# EAGLE schematic Schematic_V0.3 (EAGLE 9.7.0)
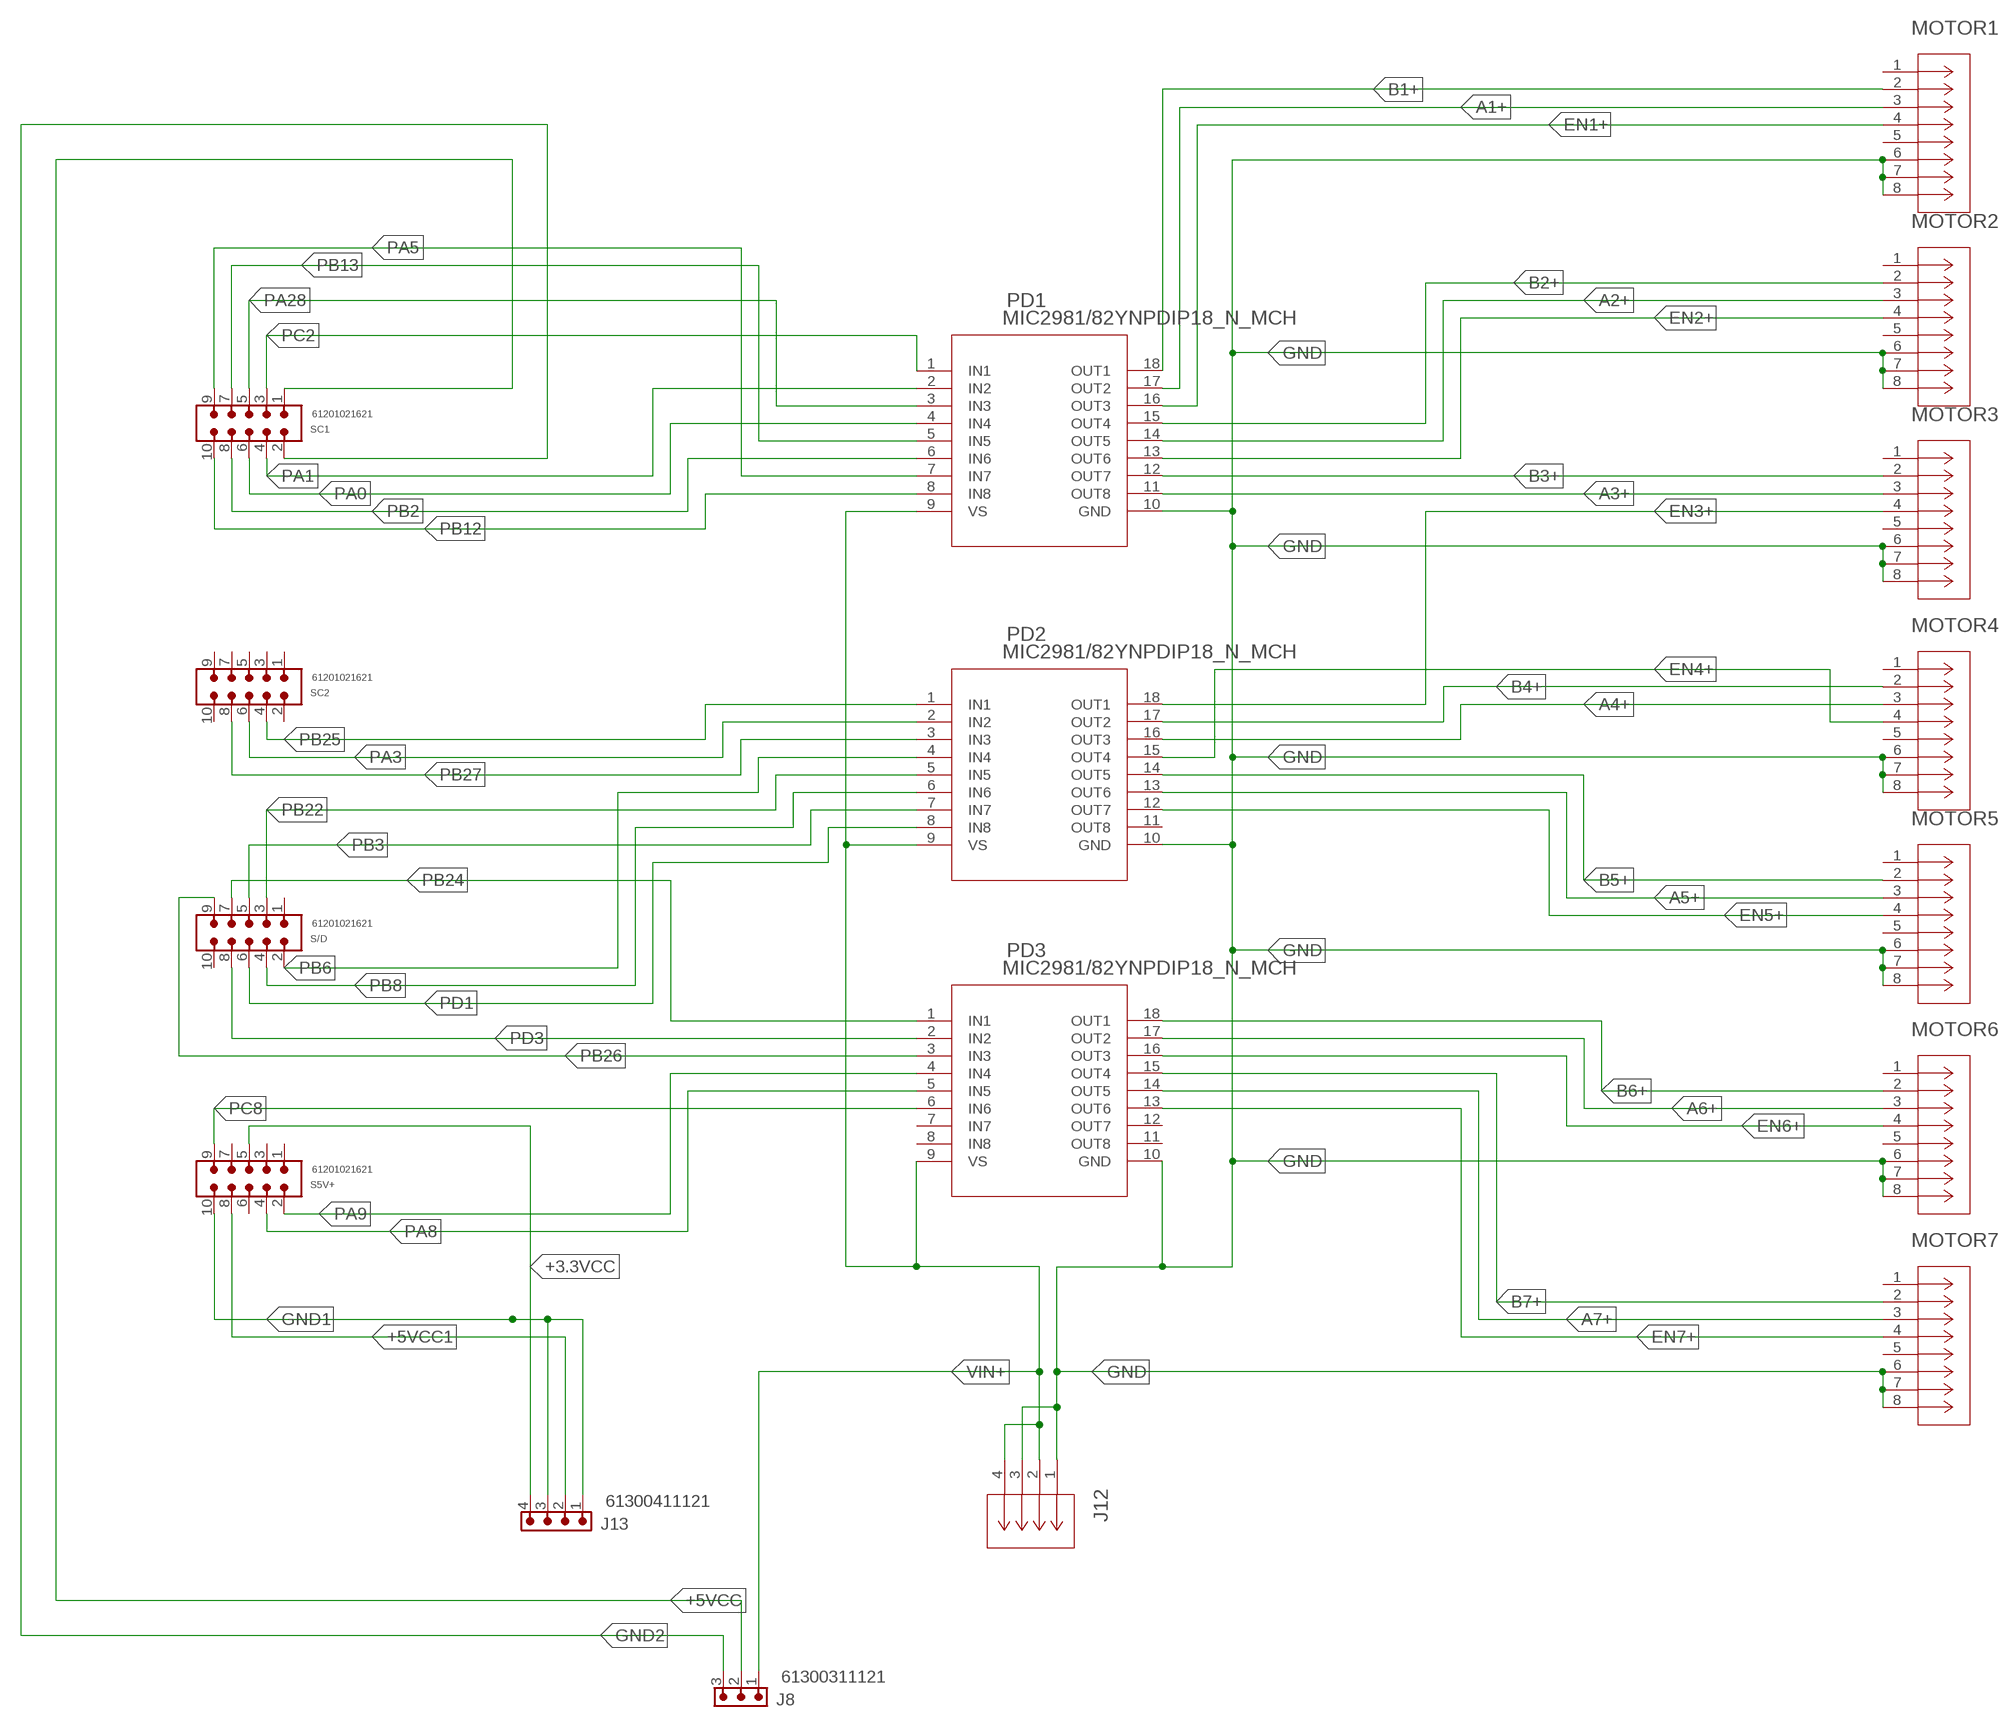
[diagram p0: schematic, sheet 1]

## Parts
J8  61300311121  6130XX11121_61300311121  [61300311121]
J12  YK3310403000GCONN_YK331040XX00G_AMP  [CONN_YK331040XX00G_AMP]
J13  61300411121  6130XX11121_61300411121  [61300411121]
MOTOR1  1724470208CON_1724470208  [CON_1724470208]
MOTOR2  1724470208CON_1724470208  [CON_1724470208]
MOTOR3  1724470208CON_1724470208  [CON_1724470208]
MOTOR4  1724470208CON_1724470208  [CON_1724470208]
MOTOR5  1724470208CON_1724470208  [CON_1724470208]
MOTOR6  1724470208CON_1724470208  [CON_1724470208]
MOTOR7  1724470208CON_1724470208  [CON_1724470208]
PD1  MIC2981/82YNPDIP18_N_MCH  [PDIP18_N_MCH]
PD2  MIC2981/82YNPDIP18_N_MCH  [PDIP18_N_MCH]
PD3  MIC2981/82YNPDIP18_N_MCH  [PDIP18_N_MCH]
S5V+  61201021621  6120XX21621_61201021621  [61201021621]
S/D  61201021621  6120XX21621_61201021621  [61201021621]
SC1  61201021621  6120XX21621_61201021621  [61201021621]
SC2  61201021621  6120XX21621_61201021621  [61201021621]

## Nets
+3.3VCC: J13.4 S5V+.5
+5VCC: J8.2 SC1.1
+5VCC1: J13.2 S5V+.8
A1+: MOTOR1.3 PD1.17(OUT2)
A2+: MOTOR2.3 PD1.14(OUT5)
A3+: MOTOR3.3 PD1.11(OUT8)
A4+: MOTOR4.3 PD2.16(OUT3)
A5+: MOTOR5.3 PD2.13(OUT6)
A6+: MOTOR6.3 PD3.17(OUT2)
A7+: MOTOR7.3 PD3.14(OUT5)
B1+: MOTOR1.2 PD1.18(OUT1)
B2+: MOTOR2.2 PD1.15(OUT4)
B3+: MOTOR3.2 PD1.12(OUT7)
B4+: MOTOR4.2 PD2.17(OUT2)
B5+: MOTOR5.2 PD2.14(OUT5)
B6+: MOTOR6.2 PD3.18(OUT1)
B7+: MOTOR7.2 PD3.15(OUT4)
EN1+: MOTOR1.4 PD1.16(OUT3)
EN2+: MOTOR2.4 PD1.13(OUT6)
EN3+: MOTOR3.4 PD2.18(OUT1)
EN4+: MOTOR4.4 PD2.15(OUT4)
EN5+: MOTOR5.4 PD2.12(OUT7)
EN6+: MOTOR6.4 PD3.16(OUT3)
EN7+: MOTOR7.4 PD3.13(OUT6)
GND: J12.1 J12.3 MOTOR1.6 MOTOR1.7 MOTOR1.8 MOTOR2.6 MOTOR2.7 MOTOR2.8 MOTOR3.6 MOTOR3.7 MOTOR3.8 MOTOR4.6 MOTOR4.7 MOTOR4.8 MOTOR5.6 MOTOR5.7 MOTOR5.8 MOTOR6.6 MOTOR6.7 MOTOR6.8 MOTOR7.6 MOTOR7.7 MOTOR7.8 PD1.10(GND) PD2.10(GND) PD3.10(GND)
GND1: J13.1 J13.3 S5V+.10
GND2: J8.3 SC1.2
PA0: PD1.4(IN4) SC1.6
PA1: PD1.2(IN2) SC1.4
PA3: PD2.2(IN2) SC2.6
PA5: PD1.7(IN7) SC1.9
PA8: PD3.5(IN5) S5V+.4
PA9: PD3.4(IN4) S5V+.2
PA28: PD1.3(IN3) SC1.5
PB2: PD1.6(IN6) SC1.8
PB3: PD2.7(IN7) S/D.5
PB6: PD2.4(IN4) S/D.2
PB8: PD2.6(IN6) S/D.4
PB12: PD1.8(IN8) SC1.10
PB13: PD1.5(IN5) SC1.7
PB22: PD2.5(IN5) S/D.3
PB24: PD3.1(IN1) S/D.7
PB25: PD2.1(IN1) SC2.4
PB26: PD3.3(IN3) S/D.9
PB27: PD2.3(IN3) SC2.8
PC2: PD1.1(IN1) SC1.3
PC8: PD3.6(IN6) S5V+.9
PD1: PD2.8(IN8) S/D.6
PD3: PD3.2(IN2) S/D.8
VIN+: J8.1 J12.2 J12.4 PD1.9(VS) PD2.9(VS) PD3.9(VS)
Unconnected: MOTOR1.1 MOTOR1.5 MOTOR2.1 MOTOR2.5 MOTOR3.1 MOTOR3.5 MOTOR4.1 MOTOR4.5 MOTOR5.1 MOTOR5.5 MOTOR6.1 MOTOR6.5 MOTOR7.1 MOTOR7.5 PD2.11(OUT8) PD3.7(IN7) PD3.8(IN8) PD3.11(OUT8) PD3.12(OUT7) S5V+.1 S5V+.3 S5V+.6 S5V+.7 S/D.1 S/D.10 SC2.1 SC2.2 SC2.3 SC2.5 SC2.7 SC2.9 SC2.10

## Library data of the parts
J8 = 6130XX11121_61300311121:6130XX11121_61300311121: WR-PHD 2.54 mm THT Pin Header ARTICLE PROPERTIES: Pins:1;​ 2;​ 3;​ 4;​ 5;​ 6;​ 7;​ 8;​ 9;​ 10;​ 12;​ 13;​ 14;​ 15;​ 16;​ 18;​ 20;​ 22;​ 24;​ 25;​ 32;​ 36;​ 40 KIND PROPERTIES: Pitch：2.54 mm Quality Class:3 as per CECC 75 301-802 Rows：Single Gender：Pin Header Type：Straight MATERIAL PROPERTIES: Insulator Material PA6T; PBT Insulator Flammability Rating:UL94 V-0 Contact Material:Copper Alloy Contact Plating:Gold Contact Type:Stamped GENERAL INFORMATION Operating Temperature:-40 up to +105 °C ELECTRICAL PROPERTIES: Withstanding Voltage 500 V (AC) Contact Resistance 20 mΩ RISO 1000 MΩ CERTIFICATION UL Approval:E323964 PACKAGING PROPERTIES Packaging:Bag <https://www.we-online.com/catalog/media/o33211v209%20Family_BTB_PHD_6130xx11121.jpg> Details see: https://www.we-online.com/katalog/en/em/PHD_2_54_THT_PIN_HEADER_6130XX11121 Updated by Ella Wu 2021-12-08 2021 (C) Würth Elektronik; DATASHEET-URL: https://www.we-online.com/redexpert/spec/61300311121?ae; GENDER: Pin Header; IR: 3A; MOUNT: THT; PACKAGING: Bag; PART-NUMBER: 61300311121; PINS: 3; PITCH: 2.54mm; ROWS: Single; TYPE: Straight
J12 = 2024-10-15_17-21-56_Library:YK3310403000G; COPYRIGHT: Copyright (C) 2024 Ultra Librarian. All rights reserved.; MANUFACTURER_PART_NUMBER: YK3310403000G; MFR_NAME: Amphenol ICC
J13 = 6130XX11121_61300411121:6130XX11121_61300411121: WR-PHD 2.54 mm THT Pin Header ARTICLE PROPERTIES: Pins:1;​ 2;​ 3;​ 4;​ 5;​ 6;​ 7;​ 8;​ 9;​ 10;​ 12;​ 13;​ 14;​ 15;​ 16;​ 18;​ 20;​ 22;​ 24;​ 25;​ 32;​ 36;​ 40 KIND PROPERTIES: Pitch：2.54 mm Quality Class:3 as per CECC 75 301-802 Rows：Single Gender：Pin Header Type：Straight MATERIAL PROPERTIES: Insulator Material PA6T; PBT Insulator Flammability Rating:UL94 V-0 Contact Material:Copper Alloy Contact Plating:Gold Contact Type:Stamped GENERAL INFORMATION Operating Temperature:-40 up to +105 °C ELECTRICAL PROPERTIES: Withstanding Voltage 500 V (AC) Contact Resistance 20 mΩ RISO 1000 MΩ CERTIFICATION UL Approval:E323964 PACKAGING PROPERTIES Packaging:Bag <https://www.we-online.com/catalog/media/o33211v209%20Family_BTB_PHD_6130xx11121.jpg> Details see: https://www.we-online.com/katalog/en/em/PHD_2_54_THT_PIN_HEADER_6130XX11121 Updated by Ella Wu 2021-12-08 2021 (C) Würth Elektronik; DATASHEET-URL: https://www.we-online.com/redexpert/spec/61300411121?ae; GENDER: Pin Header; IR: 3A; MOUNT: THT; PACKAGING: Bag; PART-NUMBER: 61300411121; PINS: 4; PITCH: 2.54mm; ROWS: Single; TYPE: Straight
MOTOR1-MOTOR7 = 2024-10-14_18-11-13_Library:1724470208; COPYRIGHT: Copyright (C) 2024 Ultra Librarian. All rights reserved.; MANUFACTURER_PART_NUMBER: 1724470208; MFR_NAME: Molex Connector Corporation
PD1-PD3 = 2024-10-01_17-12-49_Library:MIC2981/82YN; COPYRIGHT: Copyright (C) 2024 Ultra Librarian. All rights reserved.; MANUFACTURER_PART_NUMBER: MIC2981/82YN; MFR_NAME: Micrel / Microchip Technology
S5V+ S/D SC1 SC2 = 6120XX21621_61201021621:6120XX21621_61201021621: WR-BHD 2.54 mm Male Box Header KIND PROPERTIES: Pitch 2.54 mm Gender:Male MATERIAL PROPERTIES: Insulator Material:PBT Insulator Flammability Rating UL94 V-0 Insulator Color:Black Contact Material :Copper Alloy Contact Plating :Gold Contact Type: Stamped GENERAL INFORMATION: Operating Temperature:-40 °C up to +125 °C Compliance:RoHS Working Voltage: 250 V (AC) Withstanding Voltage:500 V (AC) Contact Resistance: 20 mΩ Insulation Resistance:1000 MΩ CERTIFICATION: UL Approval:E323964 PACKAGING PROPERTIES Packaging :Tray <https://www.we-online.com/catalog/media/o32884v209%20Family_WR-BHD_6120xx21621.jpg> Details see: https://www.we-online.com/catalog/en/BHD_2_54_MALE_BOX_HEADER_6120XX21621 Updated by Ella Wu 2021-3-12 2021 (C) Würth Elektronik; CONTACT-RESISTANCE: 20mOhm; DATASHEET-URL: https://www.we-online.com/redexpert/spec/61201021621?ae; GENDER: Male; IR: 3A; LENGTH: 20.36mm; MOUNT: THT; PACKAGING: Tray; PART-NUMBER: 61201021621; PINS: 10; PITCH: 2.54mm; TYPE: Straight; WORKING-VOLTAGE: 250V(AC)